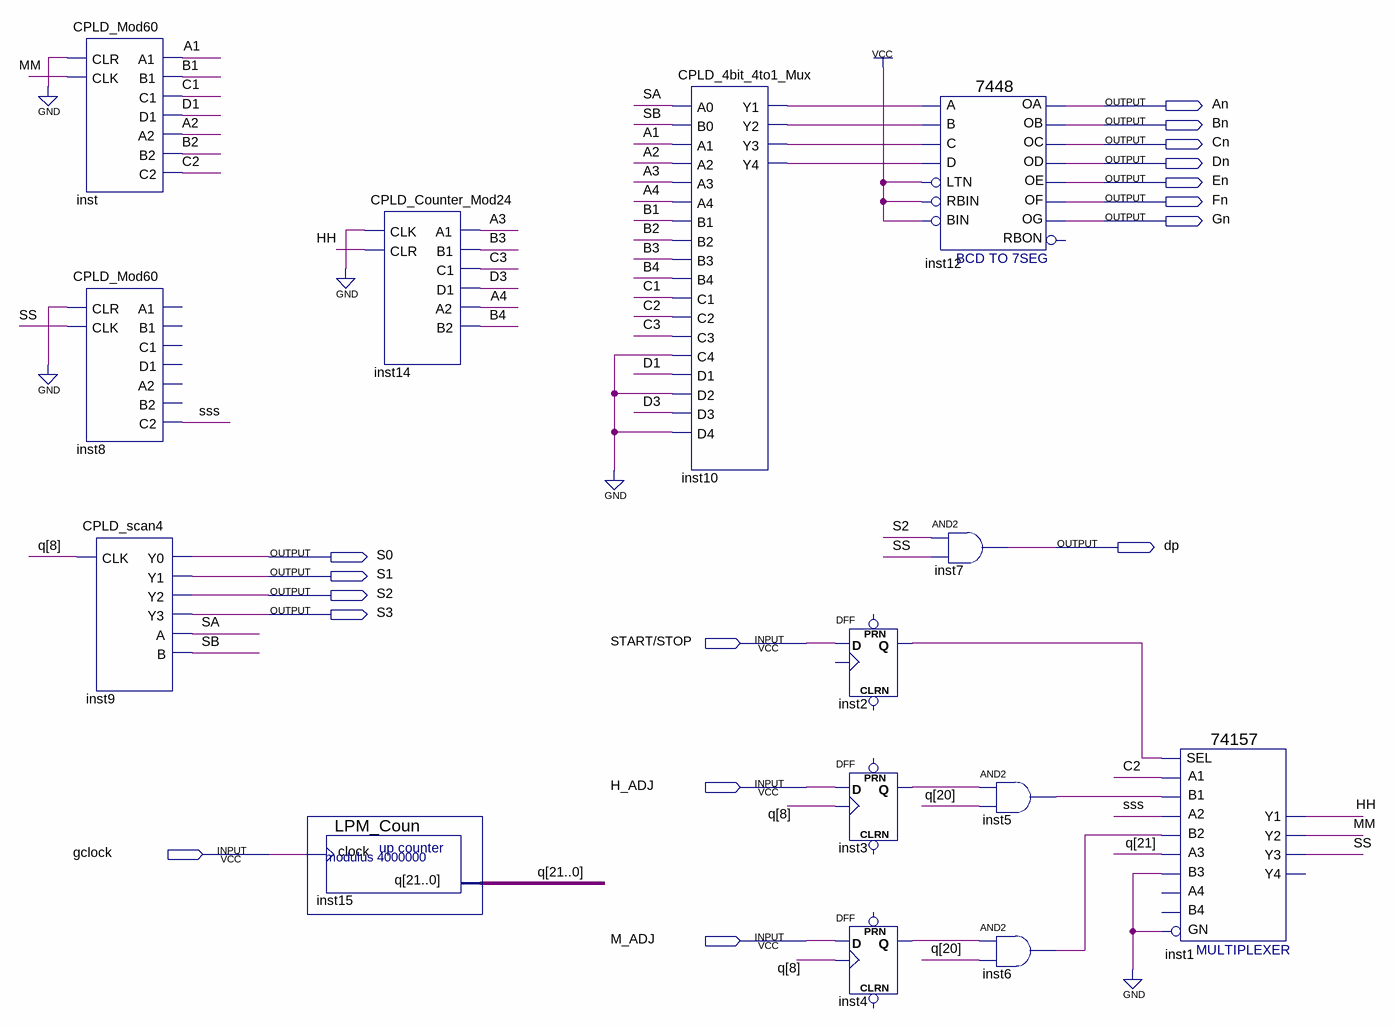
[diagram p0: schematic sheet]
// Quartus schematic CPLD_Digital_Clock.bdf as structural Verilog: 14 symbols, 16 pins
module CPLD_Digital_Clock (
  input  \START/STOP ,
  input  H_ADJ,
  input  gclock,
  input  M_ADJ,
  output An,
  output Bn,
  output Cn,
  output Dn,
  output En,
  output Fn,
  output Gn,
  output dp,
  output S0,
  output S1,
  output S2,
  output S3
);

  wire A1, A2, A3, A4, B1, B2, B3, B4, C1, C2, C3, D1, D3, HH, inst2_q, inst3_q, inst4_q, inst5_out,
       inst6_out, inst10_y1, inst10_y2, inst10_y3, inst10_y4, MM, SA, SB, SS, sss;
  wire [21:0] q;

  CPLD_Mod60 inst (.CLR(1'b0), .CLK(MM), .A1(A1), .B1(B1), .C1(C1), .D1(D1), .A2(A2), .B2(B2), .C2(C2));
  CPLD_Mod60 inst8 (.CLR(1'b0), .CLK(SS), .C2(sss));  // open: A1, B1, C1, D1, A2, B2
  CPLD_scan4 inst9 (.CLK(q[8]), .Y0(S0), .Y1(S1), .Y2(S2), .Y3(S3), .A(SA), .B(SB));
  LPM_Coun inst15 (.clock(gclock), .q(q));
  CPLD_Counter_Mod24 inst14 (.CLK(1'b0), .CLR(HH), .A1(A3), .B1(B3), .C1(C3), .D1(D3), .A2(A4), .B2(B4));
  CPLD_4bit_4to1_Mux inst10 (
    .A0(SA), .B0(SB), .A1(A1), .A2(A2), .A3(A3), .A4(A4), .B1(B1), .B2(B2), .B3(B3), .B4(B4), .C1(C1),
    .C2(C2), .C3(C3), .C4(1'b0), .D1(D1), .D2(1'b0), .D3(D3), .D4(1'b0), .Y1(inst10_y1), .Y2(inst10_y2),
    .Y3(inst10_y3), .Y4(inst10_y4));
  DFF inst2 (.D(\START/STOP ), .Q(inst2_q));  // open: CLRN, CLK, PRN
  DFF inst3 (.CLK(q[8]), .D(H_ADJ), .Q(inst3_q));  // open: CLRN, PRN
  DFF inst4 (.CLK(q[8]), .D(M_ADJ), .Q(inst4_q));  // open: CLRN, PRN
  \7448  inst12 (
    .A(inst10_y1), .C(inst10_y3), .D(inst10_y4), .B(inst10_y2), .RBIN(1'b1), .BIN(1'b1), .LTN(1'b1), .OC(Cn),
    .OE(En), .OD(Dn), .OF(Fn), .OG(Gn), .OB(Bn), .OA(An));  // open: RBON
  and inst7 (dp, S2, SS);
  and inst5 (inst5_out, inst3_q, q[20]);
  and inst6 (inst6_out, inst4_q, q[20]);
  \74157  inst1 (
    .A1(C2), .B1(inst5_out), .SEL(inst2_q), .B2(inst6_out), .A3(q[21]), .B3(1'b0), .A2(sss), .GN(1'b0),
    .Y2(MM), .Y1(HH), .Y3(SS));  // open: B4, A4, Y4
endmodule
